# Altium schematic sheet Analog_Test.SchDoc
size A
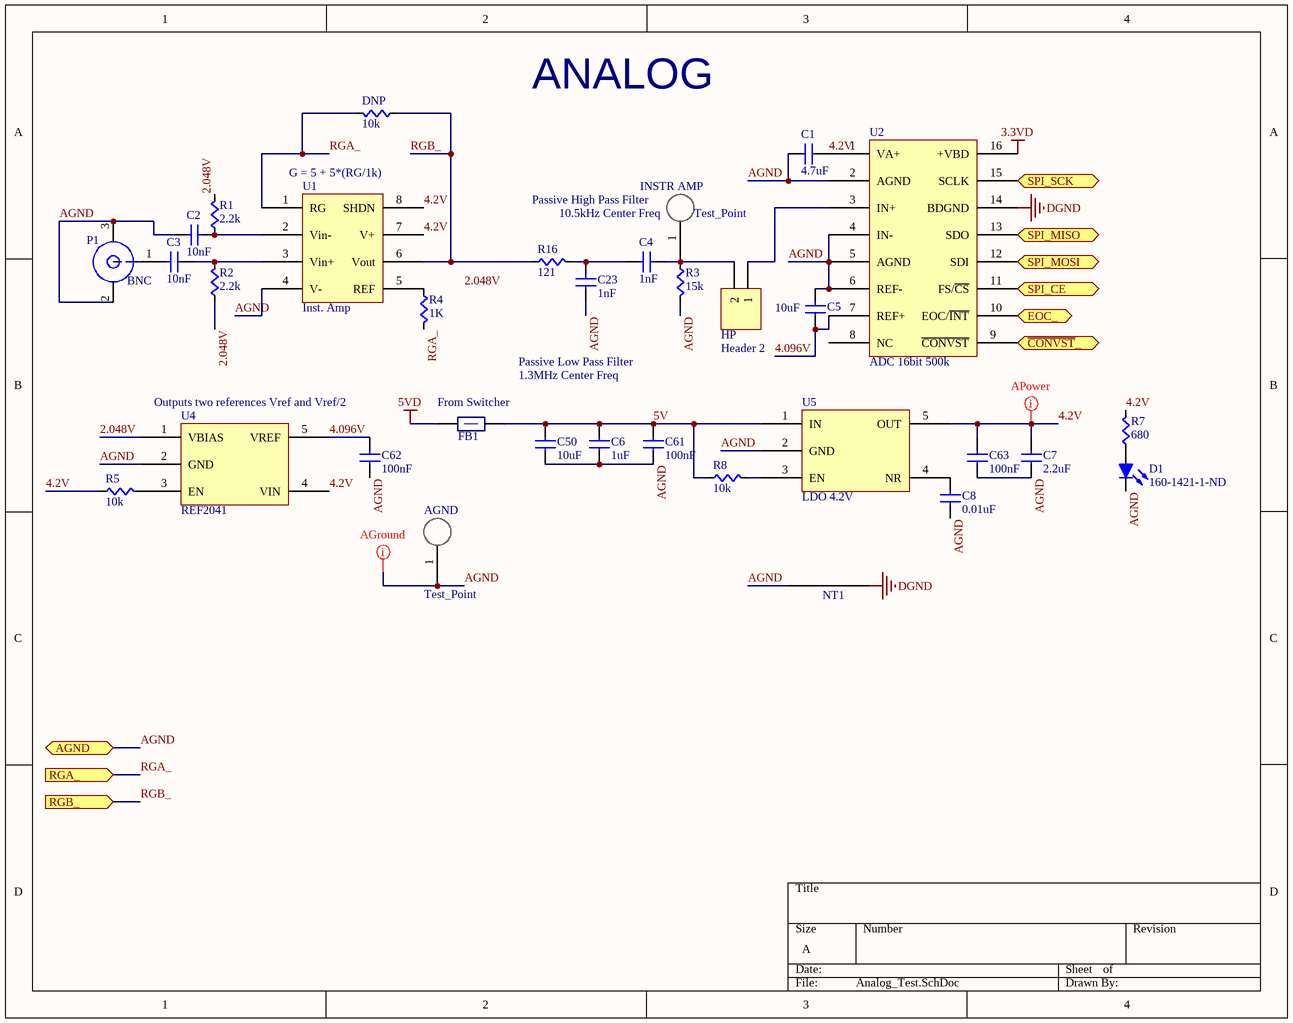
[diagram p0: Analog_Test.SchDoc]

## Parts
AGND  Test_Point  [TP]
C1  value 4.7uF  [CAPC0603]  (hidden comment: Cap)
C2  value 10nF  [CAPC0603]  (hidden comment: Cap)
C3  value 10nF  [CAPC0603]  (hidden comment: Cap)
C4  value 1nF  [CAPC0603]  (hidden comment: Cap)
C5  value 10uF  [CAPC0603]  (hidden comment: Cap)
C6  value 1uF  [CAPC0603]  (hidden comment: Cap)
C7  value 2.2uF  [CAPC0603]  (hidden comment: Cap)
C8  value 0.01uF  [CAPC0603]  (hidden comment: Cap)
C23  value 1nF  [CAPC0603]  (hidden comment: Cap)
C50  value 10uF  [CAPC0603]  (hidden comment: Cap)
C61  value 100nF  [CAPC0603]  (hidden comment: Cap)
C62  value 100nF  [CAPC0603]  (hidden comment: Cap)
C63  value 100nF  [CAPC0603]  (hidden comment: Cap)
D1  Supplier Part Number: 160-1421-1-ND  [LED0805-RED]  (hidden comment: LED-RED)
DNP  value 10k  [RES0603]  (hidden comment: Res)
FB1  FBead  [RES0603]  (value not drawn)
HP  Header 2  [HDR1X2]
INSTR_AMP  Test_Point  [TP]
NT1  NetTie  [NT_5mil]  (value not drawn)  (net tie, no BOM)
P1  BNC  [BNC Connector]
R1  value 2.2k  [RES0603]  (hidden comment: Res)
R2  value 2.2k  [RES0603]  (hidden comment: Res)
R3  value 15k  [RES0603]  (hidden comment: Res)
R4  value 1K  [RES0603]  (hidden comment: Res)
R5  value 10k  [RES0603]  (hidden comment: Res)
R7  value 680  [RES0603]  (hidden comment: Res)
R8  value 10k  [RES0603]  (hidden comment: Res)
R16  value 121  [RES0603]  (hidden comment: Res)
U1  Inst. Amp  [TSSOP-8n]
U2  ADC 16bit 500k  [TSSOP-16pin]
U4  REF2041  [SOT23-5]
U5  LDO 4.2V  [sot23-5]

## Ports
AGND (bidir), EOC_ (bidir), RGA_ (in), RGB_ (in), SPI_CE (bidir), SPI_MISO (bidir), SPI_MOSI (bidir), SPI_SCK (bidir), ~{CONVST}_ (bidir)

## Nets
3.3VD: U2.16(+VBD)
5VD: FB1.1(A)
DGND: NT1.2 U2.14(BDGND)
2.048V: R1.1(A) R2.2(B) U4.1(VBIAS)
4.2V: C1.2(B) C7.2(B) C63.1(A) R5.2(B) R7.1(A) U1.7(V+) U1.8(SHDN) U2.1(VA+) U4.4(VIN) U5.5(OUT)
4.096V: C5.2(B) C62.1(A) U2.7(REF+) U4.5(VREF)
5V: C6.2(B) C50.1(A) C61.1(A) FB1.2(B) R8.2(B) U5.1(IN)
AGND: AGND.1 C1.1(A) C2.1(A) C5.1(A) C6.1(A) C7.1(A) C8.1(A) C23.1(A) C50.2(B) C61.2(B) C62.2(B) C63.2(B) D1.1(K) NT1.1 P1.2(GND) P1.3(GND) R3.1(A) U1.4(V-) U2.2(AGND) U2.4(IN-) U2.5(AGND) U2.6(REF-) U4.2(GND) U5.2(GND) ; port AGND
~{CONVST}_: U2.9(~{CONVST}) ; port ~{CONVST}_
EOC_: U2.10(EOC/~{INT}) ; port EOC_
RGA_: DNP.1(A) R4.1(A) U1.1(RG) ; port RGA_
RGB_: DNP.2(B) R16.2(B) U1.6(Vout) ; port RGB_
SPI_CE: U2.11(FS/~{CS}) ; port SPI_CE
SPI_MISO: U2.13(SDO) ; port SPI_MISO
SPI_MOSI: U2.12(SDI) ; port SPI_MOSI
SPI_SCK: U2.15(SCLK) ; port SPI_SCK
NetC2_2: C2.2(B) R1.2(B) U1.2(Vin-)
NetC3_1: C3.1(A) P1.1(Signal)
NetC3_2: C3.2(B) R2.1(A) U1.3(Vin+)
NetC4_1: C4.1(A) C23.2(B) R16.1(A)
NetC4_2: C4.2(B) HP.2 INSTR_AMP.1 R3.2(B)
NetC8_2: C8.2(B) U5.4(NR)
NetD1_2: D1.2(A) R7.2(B)
NetHP_1: HP.1 U2.3(IN+)
NetR4_2: R4.2(B) U1.5(REF)
NetR5_1: R5.1(A) U4.3(EN)
NetR8_1: R8.1(A) U5.3(EN)

Not connected (* = marked no-connect by the designer): U2 8(NC)

## Layout directives
net class AGround: AGND
net class APower: 4.2V

## Notes on the sheet
- ANALOG
- (near U1) G = 5 + 5*(RG/1k)
- (near INSTR_AMP) Passive High Pass Filter
- (near INSTR_AMP) 10.5kHz Center Freq
- Passive Low Pass Filter
- Outputs two references Vref and Vref/2
- (near FB1) From Switcher
- 1.3MHz Center Freq
- Labels drawn without touching a wire or pin: 2.048V

## Library data of the parts
AGND INSTR_AMP = Test_Point: TEST POINT PC COMPACT .063"D; Supplier 1: Digi-Key; Supplier Part Number 1: 5006K-ND
D1 = LED-RED: Light Emitting Diode - RED; Manufacturer Part Number: LTST-C171CKT; Manufacturer: Lite-On Inc; Voltage - Forward (Vf) Typ: 1.8V; Current - Test: 20mA; Millicandela Rating: 25mcd; Viewing Angle: 130°; Color: Red; Supplier: Digi-Key; Package / Case: 0805 (2012 Metric)
FB1 = FBead: Ferrite Bead; Supplier 1: Digi-Key; Supplier Part Number 1: 445-2988-1-ND
HP = Header 2: Header, 2-Pin; LatestRevisionDate: 17-Jul-2002; LatestRevisionNote: Re-released for DXP Platform.; Publisher: Altium Limited
NT1 = NetTie: Ties two nets together
P1 = BNC Connector: CONN BNC JACK R/A 50 OHM PCB; Suplier 1: Digi-Key; Supplier Part Number 1: WM5524-ND
U1 = INA331: IC OPAMP INSTR 2MHZ RRO 8VSSOP; Suplier Part Number 1: 296-12202-1-ND; Supplier 1: Digi-Key
U2 = ADC 16bit 500k: IC ADC 16BIT 500KSPS 16-TSSOP; Supplier 1: Digi-Key; Supplier Part Number 1: 296-19764-ND
U4 = REF2041: IC VREF SERIES 2.05V/4.096V 5SOT; Supplier 1: Digi-Key; Supplier Part Number 1: 296-38497-1-ND
U5 = LDO 4.2V 200mA: IC REG LDO 4.2V 0.2A 5SOT; Supplier 1: Digi-Key; Supplier Part Number 1: 296-32585-1-ND
C1-C8 C23 C50 C61-C63 = Cap: Supplier 1: Digi-Key; Supplier Part Number 1: 1276-1000-1-ND
DNP R1-R5 R7 R8 R16 = Res: Supplier 1: Digi-Key; Supplier Part Number 1: RMCF0603JT10K0CT-ND